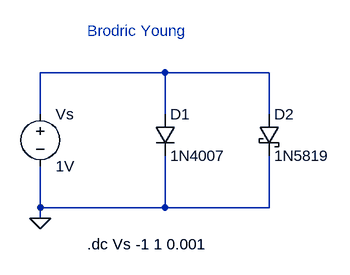
[diagram p0: schematic diode_performance.asc]
diode_performance.asc, the LTspice schematic file:
Version 4
SHEET 1 880 680
WIRE 256 64 64 64
WIRE 416 64 256 64
WIRE 64 128 64 64
WIRE 256 128 256 64
WIRE 416 128 416 64
WIRE 64 272 64 208
WIRE 256 272 256 192
WIRE 256 272 64 272
WIRE 416 272 416 192
WIRE 416 272 256 272
WIRE 64 288 64 272
FLAG 64 288 0
SYMBOL voltage 64 112 R0
SYMATTR InstName Vs
SYMATTR Value 1V
SYMBOL diode 240 128 R0
SYMATTR InstName D1
SYMATTR Value 1N4007
SYMBOL schottky 400 128 R0
SYMATTR InstName D2
SYMATTR Value 1N5819
SYMATTR Description Diode
SYMATTR Type diode
TEXT 136 328 Left 2 !.dc Vs -1 1 0.001
TEXT 136 0 Left 2 ;Brodric Young

The netlist it stands for:
* diode_performance.asc
Vs N001 0 1V
D1 N001 0 1N4007
D2 N001 0 1N5819
.model D D
.lib standard.dio
.dc Vs -1 1 0.001
* Brodric Young
.backanno
.end